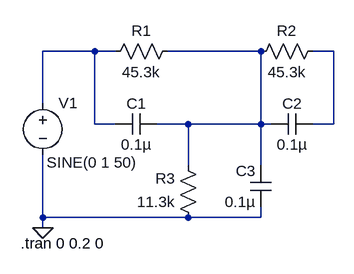
[diagram p0: schematic Circuit.asc]
Circuit.asc, the LTspice schematic file:
Version 4
SHEET 1 880 680
WIRE 16 48 -64 48
WIRE 48 48 16 48
WIRE 272 48 128 48
WIRE 384 48 352 48
WIRE -64 128 -64 48
WIRE 16 160 16 48
WIRE 48 160 16 160
WIRE 160 160 112 160
WIRE 272 160 272 48
WIRE 272 160 160 160
WIRE 288 160 272 160
WIRE 384 160 384 48
WIRE 384 160 352 160
WIRE 160 224 160 160
WIRE 272 224 272 160
WIRE -64 304 -64 208
WIRE 160 304 -64 304
WIRE 272 304 272 288
WIRE 272 304 160 304
WIRE -64 320 -64 304
FLAG -64 320 0
SYMBOL voltage -64 112 R0
WINDOW 3 6 107 Left 2
WINDOW 123 0 0 Left 2
WINDOW 39 0 0 Left 2
SYMATTR InstName V1
SYMATTR Value SINE(0 1 50)
SYMBOL res 144 32 R90
WINDOW 0 0 56 VBottom 2
WINDOW 3 32 56 VTop 2
SYMATTR InstName R1
SYMATTR Value 45.3k
SYMBOL res 368 32 R90
WINDOW 0 0 56 VBottom 2
WINDOW 3 32 56 VTop 2
SYMATTR InstName R2
SYMATTR Value 45.3k
SYMBOL res 176 320 R180
WINDOW 0 36 76 Left 2
WINDOW 3 36 40 Left 2
SYMATTR InstName R3
SYMATTR Value 11.3k
SYMBOL cap 112 144 R90
WINDOW 0 0 32 VBottom 2
WINDOW 3 32 32 VTop 2
SYMATTR InstName C1
SYMATTR Value 0.1µ
SYMBOL cap 288 288 R180
WINDOW 0 24 56 Left 2
WINDOW 3 24 8 Left 2
SYMATTR InstName C3
SYMATTR Value 0.1µ
SYMBOL cap 352 144 R90
WINDOW 0 0 32 VBottom 2
WINDOW 3 32 32 VTop 2
SYMATTR InstName C2
SYMATTR Value 0.1µ
TEXT -98 344 Left 2 !.tran 0 0.2 0

The netlist it stands for:
* Circuit.asc
V1 N001 0 SINE(0 1 50)
R1 N002 N001 45.3k
R2 N003 N002 45.3k
R3 0 N002 11.3k
C1 N002 N001 0.1µ
C3 0 N002 0.1µ
C2 N003 N002 0.1µ
.tran 0 0.2 0
.backanno
.end